# EAGLE design Adafruit Monochrome 1.12in 128x128 OLED (EAGLE 9.6.2)
COMPANY: ADAFRUIT INDUSTRIES; DRAWN: KTOWN; REV: A
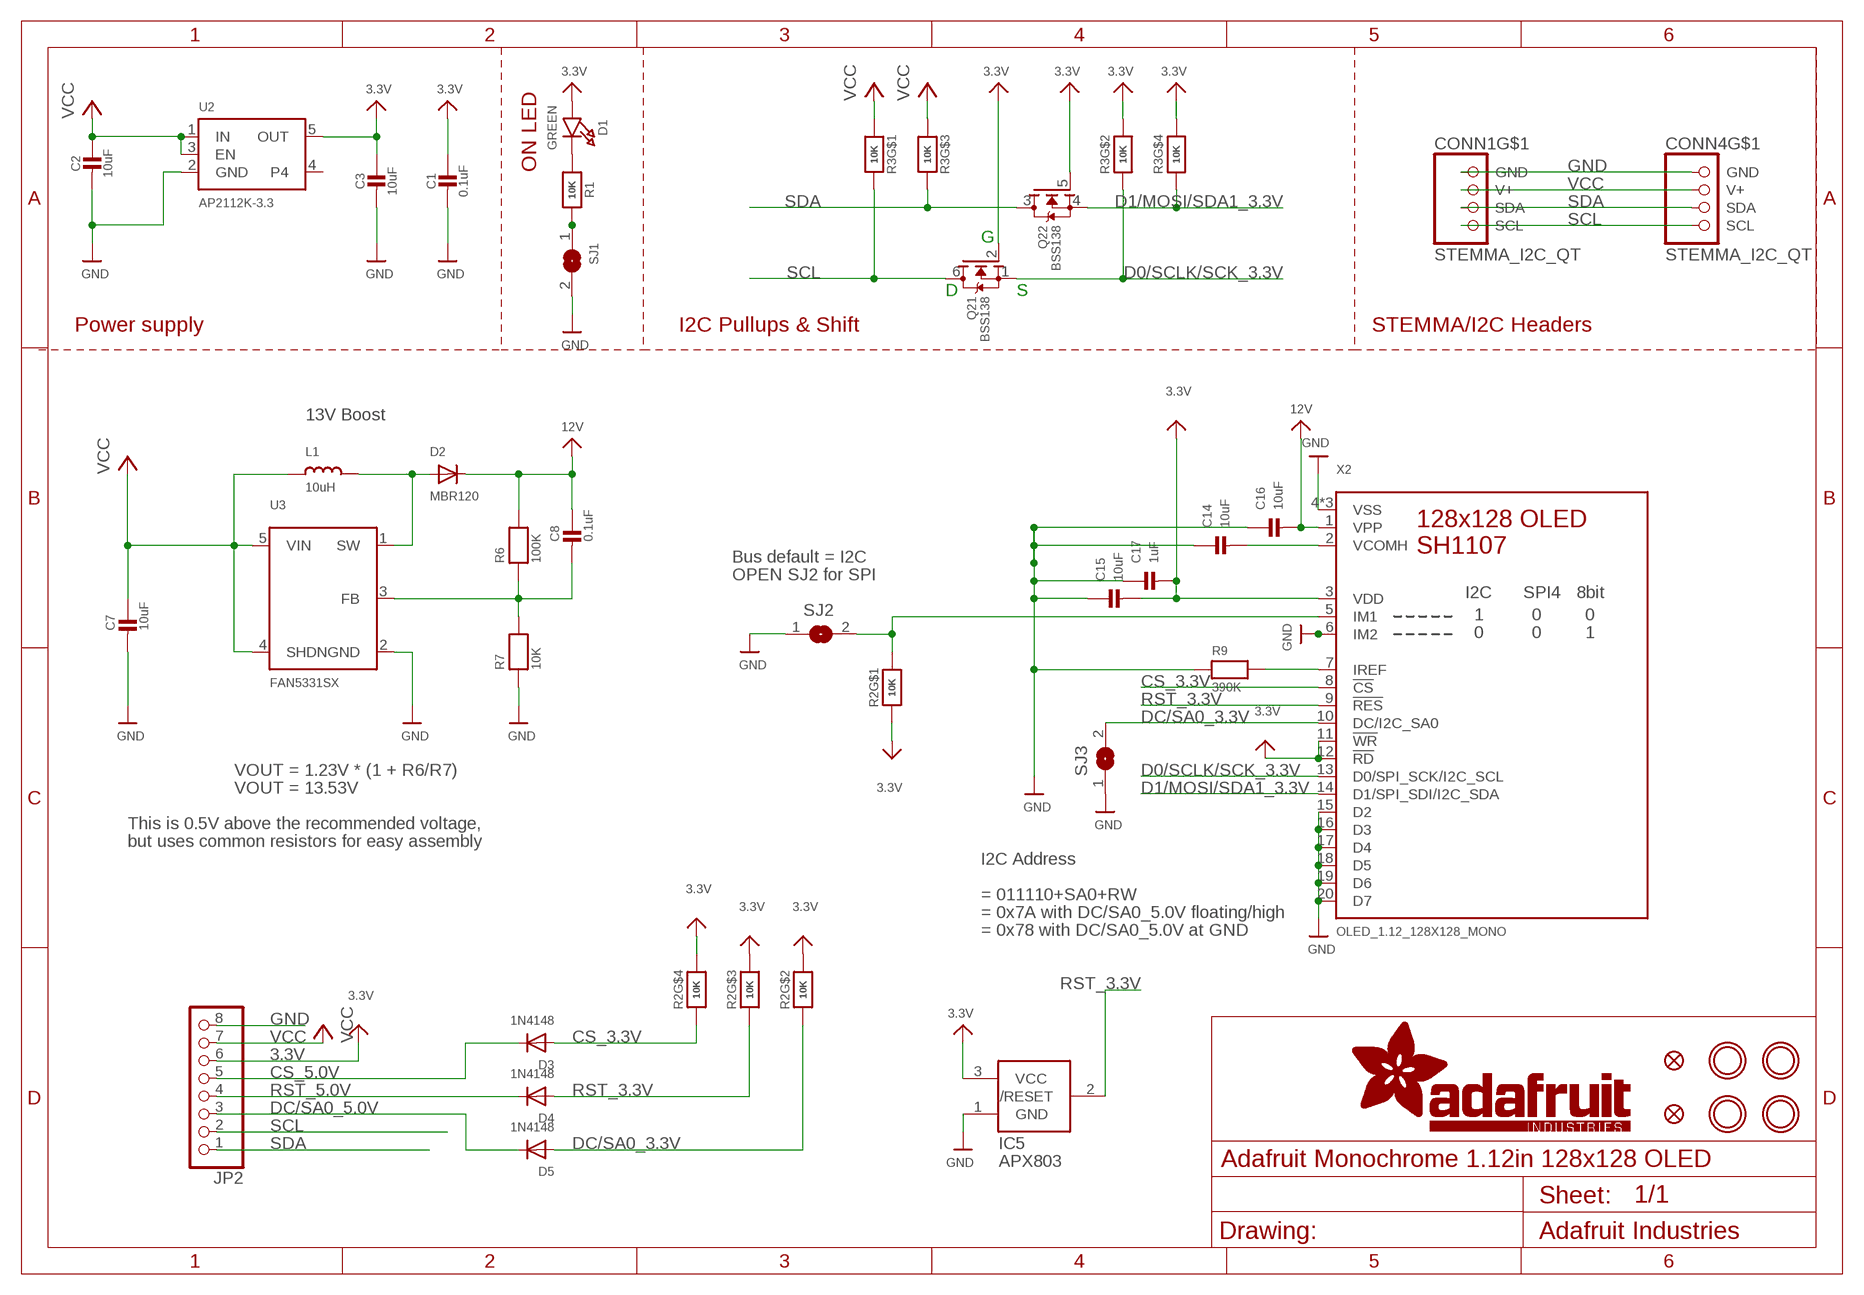
[diagram p0: schematic, sheet 1]

## Parts
C1  0.1uF  CAP_CERAMIC0603_NO  [0603-NO]
C2  10uF  CAP_CERAMIC0805-NOOUTLINE  [0805-NO]
C3  10uF  CAP_CERAMIC0805-NOOUTLINE  [0805-NO]
C7  10uF  CAP_CERAMIC0805-NOOUTLINE  [0805-NO]
C8  0.1uF  CAP_CERAMIC0603_NO  [0603-NO]
C14  10uF  CAP_CERAMIC0805-NOOUTLINE  [0805-NO]
C15  10uF  CAP_CERAMIC0805-NOOUTLINE  [0805-NO]
C16  10uF  CAP_CERAMIC0805-NOOUTLINE  [0805-NO]
C17  1uF  CAP_CERAMIC0603_NO  [0603-NO]
CONN1  STEMMA_I2C_QT  [JST_SH4]
CONN4  STEMMA_I2C_QT  [JST_SH4]
D1  GREEN  LED0603_NOOUTLINE  [CHIPLED_0603_NOOUTLINE]
D2  MBR120  DIODESOD-123  [SOD-123]
D3  1N4148  DIODESOD-323  [SOD-323]
D4  1N4148  DIODESOD-323  [SOD-323]
D5  1N4148  DIODESOD-323  [SOD-323]
FID3  FIDUCIAL_1MM  [FIDUCIAL_1MM]
FID4  FIDUCIAL_1MM  [FIDUCIAL_1MM]
IC5  APX803  AXP083-SAG  [SOT23]
JP2  HEADER-1X876MIL  [1X08_ROUND_76]
L1  10uH  INDUCTOR  [INDUCTOR_1007]
Q2  BSS138  MOSFET-N_DUAL  [SOT363]
R1  10K  RESISTOR_0603_NOOUT  [0603-NO]
R2  10K  RESISTOR_4PACK  [RESPACK_4X0603]
R3  10K  RESISTOR_4PACK  [RESPACK_4X0603]
R6  100K  RESISTOR_0603_NOOUT  [0603-NO]
R7  10K  RESISTOR_0603_NOOUT  [0603-NO]
R9  390K  RESISTOR_0603_NOOUT  [0603-NO]
SJ1  SOLDERJUMPERCLOSED  [SOLDERJUMPER_CLOSEDWIRE]
SJ2  SOLDERJUMPER  [SOLDERJUMPER_ARROW_NOPASTE]
SJ3  SOLDERJUMPER  [SOLDERJUMPER_ARROW_NOPASTE]
U2  AP2112K-3.3  VREG_SOT23-5  [SOT23-5]
U3  FAN5331SX  FAN5331  [SOT23-5@1]
U$1  MOUNTINGHOLE3.0THIN  [MOUNTINGHOLE_3.0_PLATEDTHIN]
U$17  MOUNTINGHOLE3.0THIN  [MOUNTINGHOLE_3.0_PLATEDTHIN]
U$19  MOUNTINGHOLE3.0THIN  [MOUNTINGHOLE_3.0_PLATEDTHIN]
U$21  MOUNTINGHOLE3.0THIN  [MOUNTINGHOLE_3.0_PLATEDTHIN]
X2  OLED_1.12_128X128_MONO  [OLED_1.12IN_128X128MONO]

## Nets
3.3V: C1.1 C3.1 C15.2 C17.2 D1.A IC5.3(VCC) JP2.6 Q2.2(1:G) Q2.5(2:G) R2.1 R2.5 R2.6 R2.7 R3.2 R3.4 U2.5(OUT) X2.3(VDD) X2.11(!WR) X2.12(!RD)
12V: C8.1 C16.2 D2.C R6.2 X2.1(VPP)
CS_3.3V: D3.A R2.4 X2.8(!CS)
CS_5.0V: D3.C JP2.5
D0/SCLK/SCK_3.3V: Q2.1(1:S) R3.7 X2.13(D0/SPI_SCK/I2C_SCL)
D1/MOSI/SDA1_3.3V: Q2.4(2:S) R3.5 X2.14(D1/SPI_SDI/I2C_SDA)
DC/SA0_3.3V: D5.A R2.2 SJ3.2 X2.10(DC/I2C_SA0)
DC/SA0_5.0V: D5.C JP2.3
GND: C1.2 C2.2 C3.2 C7.2 C14.1 C15.1 C16.1 C17.1 CONN1.1(GND) CONN4.1(GND) IC5.1(GND) JP2.8 R7.1 R9.1 SJ1.2 SJ2.1 SJ3.1 U2.2(GND) U3.2(GND) X2.4(VSS) X2.6(IM2) X2.15(D2) X2.16(D3) X2.17(D4) X2.18(D5) X2.19(D6) X2.20(D7) X2.21(VSS) X2.22(VSS)
N$1: R1.2 SJ1.1
N$2: D1.C R1.1
N$5: D2.A L1.P$2 U3.1(SW)
N$8: C8.2 R6.1 R7.2 U3.3(FB)
N$9: R2.8 SJ2.2 X2.5(IM1)
N$10: R9.2 X2.7(IREF)
N$15: C14.2 X2.2(VCOMH)
RST_3.3V: D4.A IC5.2(/RESET) R2.3 X2.9(!RES)
RST_5.0V: D4.C JP2.4
SCL: CONN1.4(SCL) CONN4.4(SCL) JP2.2 Q2.6(1:D) R3.8
SDA: CONN1.3(SDA) CONN4.3(SDA) JP2.1 Q2.3(2:D) R3.6
VCC: C2.1 C7.1 CONN1.2(V+) CONN4.2(V+) JP2.7 L1.P$1 R3.1 R3.3 U2.1(IN) U2.3(EN) U3.4(SHDN) U3.5(VIN)
Unconnected: CONN1.MT1(MT) CONN1.MT2(MT) CONN4.MT1(MT) CONN4.MT2(MT) U2.4

## Notes on the sheet
- ON LED
- G
- D | S
- Power supply | I2C Pullups & Shift | STEMMA/I2C Headers
- 13V Boost
- Bus default = I2C
- OPEN SJ2 for SPI
- VOUT = 1.23V * (1 + R6/R7)
- VOUT = 13.53V
- This is 0.5V above the recommended voltage,
- but uses common resistors for easy assembly
- I2C Address
- = 011110+SA0+RW
- = 0x7A with DC/SA0_5.0V floating/high
- = 0x78 with DC/SA0_5.0V at GND

## Library data of the parts
C1-C3 C7 C8 C14-C17 = microbuilder:CAP_CERAMIC: Ceramic Capacitors For new designs, use the packages preceded by an '_' character since they are more reliable: The following footprints should be used on most boards: _0402 - Standard footprint for regular board layouts _0603 - Standard footprint for regular board layouts _0805 - Standard footprint for regular board layouts _1206 - Standard footprint for regular board layouts For extremely tight-pitch boards where space is at a premium, the following 'micro-pitch' footprints can be used (smaller pads, no silkscreen outline, etc.): _0402MP - Micro-pitch footprint for very dense/compact boards _0603MP - Micro-pitch footprint for very dense/compact boards _0805MP - Micro-pitch footprint for very dense/compact boards _1206MP - Micro-pitch footprint for very dense/compact boards
CONN1 CONN4 = microbuilder:STEMMA_I2C
D1 = microbuilder:LED: LED 0603 - 0603 Surface Mount Package 2mA: Green LED - Low Power (3.9mcd, 2ma, 1.7Vf) - Digikey: 475-2709-2-ND Orange LED - Low Power (9.8mcd, 2ma, 1.8Vf) - Digikey: 475-1194-2-ND Red LED - Low Power (5mcd, 2ma, 1.8Vf) - Digikey: 475-1195-2-ND Yellow LED - Low Power (7mcd, 2ma, 1.8Vf) - Digikey: 475-1196-2-ND 5mA: Blue LED - Low Power (17mcd, 5ma, 2.9Vf) - Digikey: LNJ937W8CRACT-ND 0805 - 0805 Surface Mount Package 2mA: Red LED (8.8mcd, 2mA, 1.8Vf, Clear) - Low Power [Digikey: 475-2510-1-ND] Green LED (5mcd, 2mA, 1.8Vf, Clear) - Low Power [Digikey: 475-2730-1-ND] Yellow LED (11.3mcd, 2mA, 1.8Vf, Clear) - Low Power [Digikey: 475-2555-1-ND] 20mA: Red LED (104mcd, 20mA, Diffused) - LS R976 [Digikey: 475-1278-6-ND] Red LED (12mcd, 20mA, 2.0Vf, Clear) - APT2012EC [Digikey: 754-1128-1-ND] Green LED (15mcd, 20mA, 2.2Vf, Clear) - APT2012GC [Digikey: 754-1131-1-ND] Orange LED (160mcd, 20mA, 2.1Vf, Clear) - APT2012SECK [Digikey: 754-1130-1-ND] 1206 - 1206 Surface Mount Package Green LED (26mcd, 20mA, Diffused) - LG N971 [Digikey: 475-1407-6-ND] Red LED (15mcd, 20mA, Diffused) - LH N974 [Digikey: 475-1416-6-ND] Cree - Cree High-Power Surface Mount LEDs XPEBWT-L1-0000-00D50 - White 111lm 350mA 2.9Vf 6200K 110° XTEAWT-00-0000-00000LEE3 - White 114lm 350mA 2.85Vf 5000K 115° Everlight - Everlight 45-21 Series Surface Mount LEDs 45-21/QK2C-B2832AC2CB2/2T - Warm White 2000mcd 20mA 3.25Vf 3050K 120° 45-21/LK2C-B38452C4CB2/2T - Nuetral White 2000mcd 20mA 3.25Vf 4150K 120° 45-21/LK2C-B50634C6CB2/2T - Cold White 2200mcd 20mA 3.25Vf 5650K 120° PLCC2 Reverse Mount LS T77K-J1L2-1-0-2-R18-Z - Red 11.25mcd 2mA 1.8Vf 630nm 120° LO T77K-L1M2-24-Z - Orange 19.6mcd 2mA 1.8Vf 606nm 120° LY T77K-K2M1-26-Z - Yellow 15.7mcd 2mA 1.8Vf 587nm 120°
D2-D5 = microbuilder:DIODE: Diode SMA Model Volts Amps Type Vf Ir Digikey # Notes SSA34-E3 40V 3A Schottky 480mV @ 3A 200uA @ 40V SSA34-E3/61TGITR-ND CDBA120-G 20V 1A Schottky 500mV @ 1A 500uA @ 20V 641-1014-6-ND REEL MBRA210 10V 2A Schottky 350mV @ 2A 700uA @ 10V MBRA210LT3 SOD-123 Model Volts Amps Type Vf Ir Order # Notes BAT54T1G 30V 200mA Schottky 800mV @ 200mA 2uA @ 25V BAT54T1GOSTR-ND B0530W 30V 500mA Schottky 430mV @ 500mA 130uA @ 30V B0530W-FDICT-ND REEL MBR120 20V 1A Schottky 340mV @ 1A MBR120VLSFT1GOSCT-ND SOD-323 Model Volts Amps Type Vf Ir Order # Notes PMEG2005EJ 20V 500mA Schottky 355mV @ 500mA 568-4110-1-ND ZLLS410 10V 570mA Schottky 380mV @ 570mA ZLLS410CT-ND 1N4148WS 75V 150mA Silicon/Simple 1V 1N4148WSFSCT-ND REEL SOD-523 Model Volts Amps Type Vf Ir Order # Notes BAT54XV2 30V 200mA Schottky 0.8V @ 100mA BAT54XV2CT-ND TB751S 30V 30mA Schottky RB751S-40TE61CT-ND SOT23-R/W (R = Solder Paste/Reflow Ovens, W = Hand-Soldering) Model Volts Amps Type Vf Ir Order # Notes BAT54FILM 40V 300mA Schottky 497-7162-1-ND POWERDI-5 Model Volts Amps Type Vf Ir Order # Notes PDS560 60V 5A Schottky 670mV @ 5A 150uA @ 60V PDS560DICT-ND
FID3 FID4 = microbuilder:FIDUCIAL: Fiducial Alignment Points Various fiducial points for machine vision alignment.; BOM: EXCLUDE
IC5 = adafruit:AXP083
JP2 = microbuilder:HEADER-1X8: PIN HEADER
L1 = microbuilder:INDUCTOR: Inductors 0603: 10nH Ceramic Inductor - microwire antenna/RF (Digikey: 712-1434-2-ND) 0805: 560nH Ceramic Inductor - RF (Digikey: 553-1047-1-ND) 270nH Ceramic Inductor - Q = 40@250MHz, +-5%, 1 Ohm DC Resistance (Digikey: 535-10506-2-ND) 1007 (2518 Metric) SMT: 10µH 10% 250mOhm 820mA 1007 Inductor (Digikey: 587-2189-1-ND) 22µH 10% 500mOhm 580mA 1007 Inductor (Digikey: 587-2190-1-ND) 47µH 10% 950mOhm 420mA 1007 Inductor (Digikey: 587-2191-1-ND) 47µH 5% 100mOhm 1A 1008 Inductor (Digikey: 732-1816-1-ND) 5.0x5.0mm (Taiyo Yuden NR5040 Series) 6.8µH 20% 2.3A 64mOhm Inductor (Digikey: 587-2374-2-ND) 5.0x5.0mm (TDK VLC5045 Series) 4.7µH 20% 3.3A 34mOhm Inductor (Digikey: 445-6526-1-ND) 6.8µH 20% 2.7A 46mOhm Inductor (Digikey: 445-6527-1-ND) 6.0x6.0mm (TDK VLC6045 Series) 4.7µH 20% 3.8A 27mOhm Inductor (Digikey: 445-6538-2-ND) 6.8µH 20% 3A 41mOhm Inductor (Digikey: 445-6540-1-ND) 6.2µH 30% 2.2A 45mOhm Inductor (Digikey: SRR5028-6R2YCT-ND) - Not TDK VLC6045 but footprint should match 6.0x6.0mm (TDK SLF6045 Series) 6.8uH 30% 2A 33mOhm Inductor (Digikey: 445-4572-1-ND, Mouser: 810-SLF645T6R8N2R0PF) 6.0x6.0mm (Sumida CDRH5D28 Series) 6.2uH 30% 1.8A 45mOhm Inductor (Digikey: 308-1542-1-ND) Taiyo Yuden NR3015T2R2M - 2.2uH 20% 1.5A (Digikey: 587-1648-2-ND, Mouser: 963-NR3015T2R2M) - Used with TI TPS62172 CoilCraft RFID Transponder Coil - MA5532-AE (For use with AS3935 Lightning Sensor) Taiyo Yuden NRH2412T2R2MNGH - 2.2uH 20% 1AA (Digikey: 587-3443-1-ND) - Used with TI LM3671 Vishay IHLP 1.0uH Molded Inductor - 24mOhm DCR, 5A, +/-20%, -55°C-125°C (Digikey: 541-1319-1-ND)
Q2 = microbuilder:MOSFET-N_DUAL: Dual N-Channel MOSFET SOT363 (2.0x1.25mm) 2N7002PS - 60V, 320mA [Digikey: 568-5984-1-ND]
R1 R6 R7 R9 = microbuilder:RESISTOR: Resistors For new designs, use the packages preceded by an '_' character since they are more reliable: The following footprints should be used on most boards: _0402 - Standard footprint for regular board layouts _0603 - Standard footprint for regular board layouts _0805 - Standard footprint for regular board layouts _1206 - Standard footprint for regular board layouts For extremely tight-pitch boards where space is at a premium, the following 'micro-pitch' footprints can be used (smaller pads, no silkscreen outline, etc.): _0402MP - Micro-pitch footprint for very dense/compact boards _0603MP - Micro-pitch footprint for very dense/compact boards _0805MP - Micro-pitch footprint for very dense/compact boards _1206MP - Micro-pitch footprint for very dense/compact boards
R2 R3 = microbuilder:RESISTOR_4PACK: Resistor Packs (4 resistors) 4 x 0603 10K 1/16W - Digikey: YC164J-10KCT-ND
SJ1 = microbuilder:SOLDERJUMPER: SMD Solder JUMPER Solder the two pads together to create a connection, or remove the solder to break it. REFLOW - Use this footprint for solder paste and reflow ovens. WAVE - Use this footprint for hand-soldering (larger pads). CLOSED - Has a trace between the two pads to ensure it is closed by default. The trace needs to be cut to disable the jumper, and can be closed again by creating a solder bridge between the two pads.
SJ2 SJ3 = microbuilder:SOLDERJUMPER: SMD Solder JUMPER Solder the two pads together to create a connection, or remove the solder to break it. REFLOW - Use this footprint for solder paste and reflow ovens. WAVE - Use this footprint for hand-soldering (larger pads). CLOSED - Has a trace between the two pads to ensure it is closed by default. The trace needs to be cut to disable the jumper, and can be closed again by creating a solder bridge between the two pads.; BOM: EXCLUDE
U2 = microbuilder:VREG_SOT23-5: SOT23-5 Fixed Voltage Regulators Part Current Out V Out V In V Dropout θJA (°C/W) TJ (°C) Digikey Part No. ADP121 150mA 3.3V 3.4-5.5V 0.09V @ 150mA -- -- ADP121-AUJZ33R7CT-ND ADP121 150mA 3.0V 3.1-5.5V 0.09V @ 150mA -- -- ADP121-AUJZ30R7CT-ND ADP122 300mA 3.3V 3.4-5.5V 0.085V @ 300mA -- -- ADP122AUJZ-3.3-R7CT-ND ADP1712 300mA 3.3V 3.5-5.5V 0.17V @ 300mA -- -- ADP1712AUJZ-3.3-R7TR-ND AP7311 (Low Cost) 150mA 3.3V 3.5-6V 0.15V @ 150mA -- -- AP7311-33WG-7DICT-ND LD39015M18R 150mA 1.8V 1.9V-5.5V 0.08V @ 100mA -- -- 497-6977-1-ND LP2985A-33DBVR 150mA 3.3V 3.3-16V 0.28V @ 150mA 206 150 296-18479-1-ND MCP1824T-3302E/OT 300mA 3.3V 3.5V-6V 0.2V @ 300mA -- -- MCP1824T-3302E/OTCT-ND MIC5205-2.5YM5 TR 150mA 2.5V 2.7-16V 0.165V @ 150mA -- -- 576-1257-2-ND MIC5205-3.0YM5 TR 150mA 3.0V 3.2V-16V 0.165V @ 150mA -- -- 576-1258-2-ND MIC5205-3.3YM5 TR 150mA 3.3V 3.5V-16V 0.165V @ 150mA -- -- 576-1259-2-ND TPS780330220 150mA 3.3V+2.2V 3.6-5.5V 250mV Max -- -- 296-23332-1-ND TDA3663/N1,135 100mA 3.3V 3.5-45V 0.18V @ 50mA -- -- 568-5343-1-ND Max operating temp can be calculated using θJA, TJ (max junction temperature), and power in watts. Set the "Maximum Ambient Temperature" until it reaches TJ ("Max Junction Temperature"), which is the absolute limit for safe use of the regulator: Heat Sink Temperature Calculator <http://www.daycounter.com/Calculators/Heat-Sink-Temperature-Calculator.phtml> For example, With 12V source into a 3.3V LP2985 and a 30mA load, we are dissipating (12V-3.3V) * 0.03A = 0.261W. With a θJA of 206 °C/W, a TJ of 150°C, and 261mW we can safely use the chip without a heat sink up to 75°C (=147.1°C Junction Temperature).
U3 = microbuilder:FAN5331: FAN5331 - LED/OLED 20V Boost Converter Digikey: FAN5331SXCT-ND
U$1 U$17 U$19 U$21 = microbuilder:MOUNTINGHOLE: Mounting Hole For #2 screws (0.086"/2.18mm width, 0.094"/2.4mm hole) use 2.5mm; BOM: EXCLUDE
X2 = adafruit_display:OLED_1.12_128X128_MONO

## Board
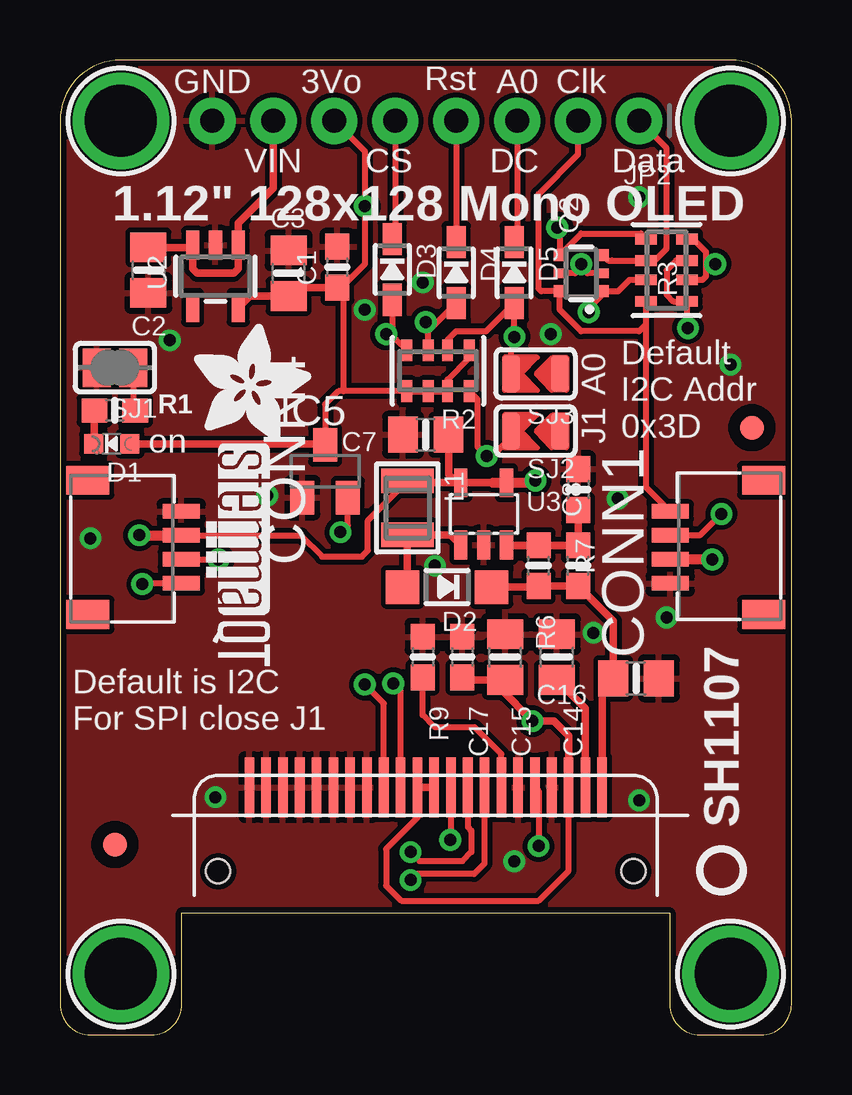
[diagram p1: board, top side]
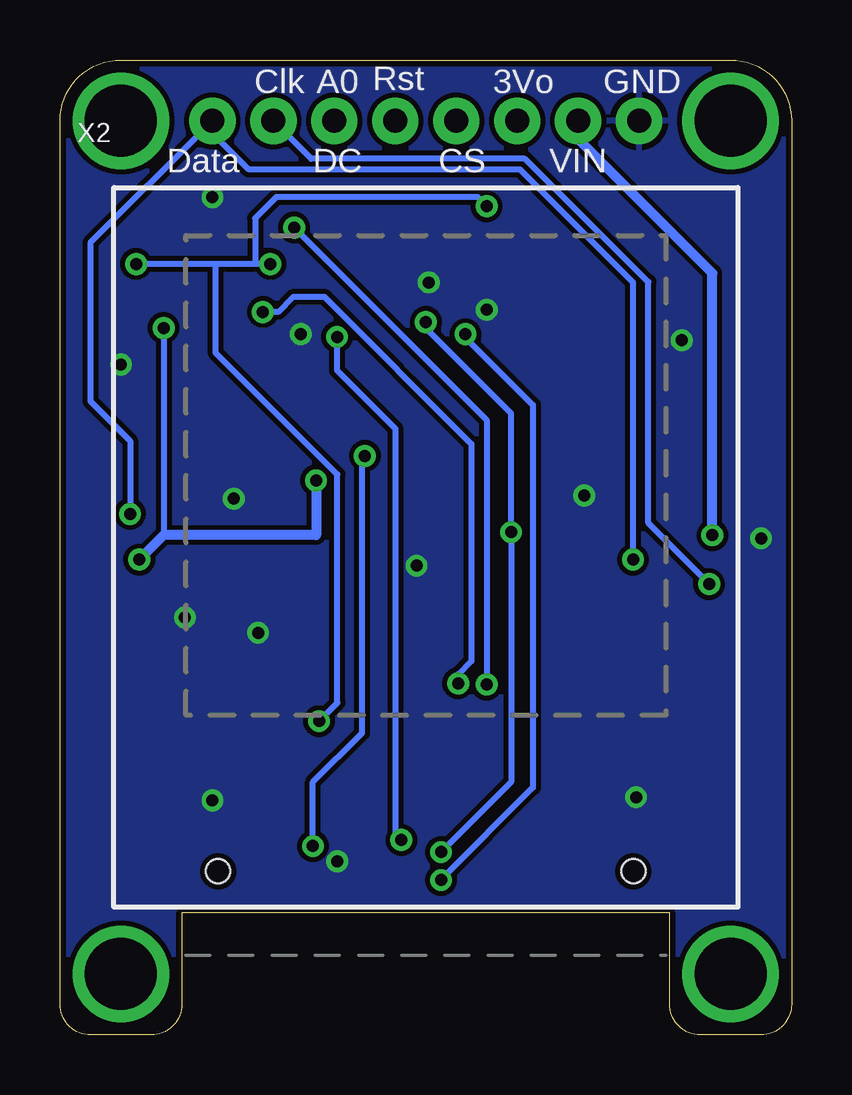
[diagram p2: board, bottom side, seen from below]

Size 30.48 x 40.64 mm. Coordinates in mm from the lower left corner, seen from the top.
Outline: 26.67,0 29.21,0 arc90 30.48,1.27 30.48,38.1 arc90 27.94,40.64 2.54,40.64 arc90 0,38.1 0,1.27 arc90 1.27,0 3.81,0 arc90 5.08,1.27 5.08,5.08 25.4,5.08 25.4,1.27 arc90 26.67,0
Copper layers (1*16): Top 0.035mm / dielectric 1.5mm / Bottom 0.035mm
Design rules "adafruit *": minimum track width 8mil, minimum drill 15.5mil, track to track 8mil, track to pad 8mil, pad to pad 8mil, via to via 8mil, smd to smd 8mil, copper to edge 10mil, drill to drill 8mil, minimum pad ring 10mil, minimum via ring 8mil, stop-mask expansion 2mil, vias tented up to drill 20mil, thermal gap 10mil

### Footprints (pad centres in the part's own frame; a part is rotated, then mirrored left to right if it is on the bottom)
0603-NO = smd 1.075 x 1: 1 -0.85,0; 2 0.85,0
0805-NO = smd 1.24 x 1.5: 1 -0.95,0; 2 0.95,0
JST_SH4 = smd 0.6 x 1.55: 1 -1.5,2.514; 2 -0.5,2.514; 3 0.5,2.514; 4 1.5,2.514 | smd 1.2 x 1.8: MT1 -2.8,-1.386; MT2 2.8,-1.386
CHIPLED_0603_NOOUTLINE = smd 0.8 x 0.8: A 0,-0.75; C 0,0.75
SOD-123 = smd 1.4 x 1.4: A 1.85,0; C -1.85,0
SOD-323 = smd 1.35 x 0.8: A 1.27,0; C -1.27,0
FIDUCIAL_1MM = smd 1 x 1: 1 0,0
SOT23 = smd 1 x 1.4: 1 -0.95,-1.1; 2 0.95,-1.1; 3 0,1.1
1X08_ROUND_76 = drill 1 pad 1.93: 1 -8.89,0; 2 -6.35,0; 3 -3.81,0; 4 -1.27,0; 5 1.27,0; 6 3.81,0; 7 6.35,0; 8 8.89,0
INDUCTOR_1007 = smd 1.016 x 2.2: P$1 -1.127,0; P$2 1.127,0
SOT363 = smd 0.5 x 0.5: 1 -0.75,-0.9; 3 0.75,-0.9; 4 0.75,0.9; 6 -0.75,0.9 | smd 0.4 x 0.5: 2 0,-0.9; 5 0,0.9
RESPACK_4X0603 = smd 0.45 x 0.9: 1 -1.3,-0.85; 2 -0.4,-0.85; 3 0.4,-0.85; 4 1.3,-0.85; 5 1.3,0.85; 6 0.4,0.85; 7 -0.4,0.85; 8 -1.3,0.85
SOLDERJUMPER_CLOSEDWIRE = smd 1.168 x 1.6: 1 -0.762,0; 2 0.762,0 | smd 0.635 x 0.203: WIRE 0,0
SOLDERJUMPER_ARROW_NOPASTE = smd 0.762 x 1.524: 1 -1.016,0; 2 1.016,0
SOT23-5 = smd 0.55 x 1.2: 1 -0.95,-1.3; 2 0,-1.3; 3 0.95,-1.3; 4 0.95,1.3; 5 -0.95,1.3
SOT23-5@1 = smd 0.55 x 1.2: 1 -0.95,-1.3; 2 0,-1.3; 3 0.95,-1.3; 4 0.95,1.3; 5 -0.95,1.3
MOUNTINGHOLE_3.0_PLATEDTHIN = drill 3 pad 3.6: P$1 0,0
OLED_1.12IN_128X128MONO = smd 0.4 x 2.5 bottom: 1 -7.35,-10; 2 -6.65,-10; 3 -5.95,-10; 4 -5.25,-10; 5 -4.55,-10; 6 -3.85,-10; 7 -3.15,-10; 8 -2.45,-10; 9 -1.75,-10; 10 -1.05,-10; 11 -0.35,-10; 12 0.35,-10; 13 1.05,-10; 14 1.75,-10; 15 2.45,-10; 16 3.15,-10; 17 3.85,-10; 18 4.55,-10; 19 5.25,-10; 20 5.95,-10; 21 6.65,-10; 22 7.35,-10 | hole 1: -8.65,-13.5; 8.65,-13.5

### Placement (x,y rotation side)
C1  11.56,32 90 top
C2  3.68,31.88 270 top
C3  9.53,31.75 90 top
C7  15.24,25.02 180 top
C8  21.59,19.56 90 top
C14  20.7,15.75 270 top
C15  18.54,15.75 270 top
C16  24,14.86 180 top
C17  16.76,15.75 270 top
CONN1  27.94,20.32 90 top
CONN4  2.54,20.32 270 top
D1  2.16,24.64 90 top
D2  16.13,18.67 180 top
D3  13.84,31.9 270 top
D4  16.51,31.78 270 top
D5  18.92,31.78 270 top
FID3  2.29,7.94 0 top
FID4  28.83,25.31 0 top
IC5  11.05,23.49 0 top
JP2  15.24,38.1 180 top
L1  14.48,21.97 270 top
Q2  21.72,31.75 90 top
R1  2.29,26.03 0 top
R2  15.75,27.69 180 top
R3  25.27,31.88 90 top
R6  19.94,19.56 270 top
R7  21.59,22.73 270 top
R9  15.11,15.75 270 top
SJ1  2.29,27.81 180 top
SJ2  19.81,25.17 180 top
SJ3  19.81,27.56 180 top
U2  6.48,31.62 180 top
U3  17.65,21.72 0 top
U$1  2.54,38.1 0 top
U$8  [ADAFRUIT_5MM]  5.59,24.77 0 top
U$17  27.94,38.1 0 top
U$19  2.54,2.54 0 top
U$21  27.94,2.54 0 top
U$25  [PCBFEAT-REV-040]  27.56,6.86 0 top
U$31  [STEMMAQT]  6.1,24.64 270 top
X2  15.24,20.32 0 bottom

### Tracks (layer width: path | path; a pad name or v marks a point on that pad's centre or on a via)
3.3V  (via drill 0.5)
  Top 0.254: v21.72,32.13 21.72,32.02 | 21.72,32.02 21.45,31.75 Q2.5 | R3.2 26.78,31.48 26.92,31.62 26.92,32.13 | 26.92,32.13 26.92,32.64 26.39,33.18 R3.4 | Q2.2 21.98,31.75 21.72,32.02 | v27.3,32.13 26.92,32.13 | JP2.6 12.7,36.83 v12.7,34.54 12.7,32.13 11.56,30.99 | X2.12 14.89,9.05 13.59,7.75 13.59,6.22 14.22,5.59 19.94,5.59 21.19,6.84 X2.3 | R2.7 16.15,27.32 17.05,28.22 R2.1 | R2.5 11.81,26.84 | 11.81,26.84 11.6,26.84 11.05,26.29 IC5.3 | C1.1 11.81,30.9 11.81,26.84 | 19.49,13.27 v19.68,13.08
  Top 0.305: U2.5 7.9,30.8 C3.1 9.88,31.15 C1.1 11.56,30.99 | R2.5 R2.6 R2.7 | D1.A 11.01,24.64 IC5.3 | X2.12 X2.11 | C17.2 16.76,14.86 16.82,14.8 C15.2 18.54,14.22 19.49,13.27 | X2.3 21.19,12.46 20.57,13.08 v19.68,13.08
  Bottom 0.254: v21.72,32.13 22.35,32.13 | 22.35,32.13 24,32.13 | 24,32.13 v27.3,32.13 | 24,32.13 24,28.45 18.92,23.37 18.92,13.84 v19.68,13.08 | v12.7,34.54 13.08,34.92 21.46,34.92 22.35,34.04 22.35,32.13
12V
  Top 0.305: X2.1 22.59,14.4 C16.2 23.05,17.24 C8.1 R6.2 19.9,18.67 D2.C
CS_3.3V  (via drill 0.5)
  Top 0.254: D3.A 13.84,29.14 14,28.98 | 14,28.98 R2.4 | 14,28.98 13.81,28.98 v13.59,29.21 | v14.61,6.46 14.86,6.71 17.25,6.71 17.69,7.15 X2.8
  Bottom 0.254: v13.59,29.21 13.59,29.07 10.77,26.26 10.77,10.31 14.61,6.48 v14.61,6.46
CS_5.0V
  Top 0.254: JP2.5 13.97,33.3 D3.C
D0/SCLK/SCK_3.3V  (via drill 0.5)
  Top 0.254: Q2.1 22.73,31 | 22.73,31 23.25,31 23.73,31.48 R3.7 | X2.13 14.19,14.35 v13.89,14.65 | v22.03,30.13 21.95,30.21 22.73,31
  Bottom 0.254: v13.89,14.65 13.89,15.03 13.34,15.59 13.34,24.64 19.46,30.77 20.76,30.77 21.39,30.13 v22.03,30.13
D1/MOSI/SDA1_3.3V  (via drill 0.5)
  Top 0.254: R3.5 24.2,33.4 21.72,33.4 Q2.4 20.82,33.56 v20.72,33.66 | X2.14 13.49,13.81 v12.7,14.61
  Bottom 0.254: v12.7,14.61 12.7,25.63 v20.72,33.66
DC/SA0_3.3V  (via drill 0.5)
  Top 0.254: R2.2 16.15,28.98 16.51,29.34 17.75,29.34 D5.A 18.92,29.1 v18.94,29.1 18.94,28.72 18.8,28.58 SJ3.2 | X2.10 16.29,8.16 v16.26,8.13
  Bottom 0.254: v16.26,8.13 16.51,8.38 16.51,25.27 18.94,27.7 v18.94,29.1
DC/SA0_5.0V
  Top 0.254: JP2.3 19.05,33.17 D5.C
GND  (via drill 0.5)
  other vias: 23.24,22.35 15.62,19.56 22.23,16.76 25.27,17.4 8.64,22.48 12.7,30.23 15.11,31.37 20.45,29.21 27.94,27.94 24.13,34.92 4.57,28.96 1.27,20.7 6.48,9.91 24.13,9.78 18.92,7.24
  pour Top: 0,40.64 30.48,40.64 30.48,0 29.72,0 0,0
  pour Bottom: 0,40.64 30.48,40.64 30.48,0 0,0
N$1
  Top 0.254: SJ1.1 3.05,26.12 R1.2
N$2
  Top 0.305: R1.1 1.44,24.66 D1.C
N$5
  Top 0.305: U3.1 16.28,20.84 L1.P$2 14.48,18.87 D2.A
N$8
  Top 0.305: R7.2 C8.2 R6.1 18.61,20.41 U3.3
N$9  (via drill 0.5)
  Top 0.254: X2.5 19.94,10.17 v19.94,7.87 | R2.8 17.4,26.48 17.4,24.51 v17.78,24.13 18.01,24.13 18.8,24.91 SJ2.2
  Bottom 0.254: v19.94,7.87 19.94,10.54 17.91,12.57 17.91,24 v17.78,24.13
N$10
  Top 0.254: X2.7 18.39,11.71 17.27,12.83 15.62,12.83 15.11,13.34 R9.2
N$15
  Top 0.305: X2.2 21.89,13.61 C14.2
RST_3.3V  (via drill 0.5)
  Top 0.254: R2.3 15.35,29.34 | 15.35,29.34 D4.A | X2.9 16.99,8.66 17.14,8.51 17.14,7.62 16.76,7.24 14.99,7.24 v14.61,7.62 | v11.68,20.95 11.7,20.95 12,21.25 IC5.2 | v15.24,29.72 15.35,29.61 15.35,29.34
  Bottom 0.254: v14.61,7.62 11.68,10.54 v11.68,20.95 11.68,25.91 15.24,29.46 v15.24,29.72
RST_5.0V
  Top 0.254: JP2.4 D4.C
SCL  (via drill 0.5)
  Top 0.254: 24.42,29.63 24.13,29.34 21.72,29.34 20.82,30.24 Q2.6 20.05,31 19.94,31.12 19.94,35.05 21.59,36.7 JP2.2 | CONN1.4 24.42,22.82 24.42,29.63 | 24.42,29.63 R3.8 | CONN4.4 3.45,18.82 v3.43,18.8
  Bottom 0.254: v3.43,18.8 5.97,21.34 5.97,31.38 11.11,36.52 20.02,36.52 JP2.2
SDA  (via drill 0.5)
  Top 0.254: Q2.3 22.84,32.28 23,32.28 23.01,32.28 R3.6 24.78,32.28 25.27,32.77 25.27,36.96 JP2.1 | v27.56,21.72 26.66,20.82 CONN1.3 | CONN4.3 v6.6,19.82 v6.6,19.81
  Bottom 0.254: JP2.1 24.38,37.85 | 24.38,37.85 29.21,33.02 29.21,26.42 27.56,24.77 v27.56,21.72 | v6.6,19.81 6.6,31.37 11.3,36.07 22.61,36.07 24.38,37.85
VCC  (via drill 0.5)
  Top 0.254: R3.3 25.67,32.28 25.27,31.88 25.27,30.86 25.56,30.58 R3.1 26.12,29.5 v26.16,29.46 | CONN4.2 10.04,20.82 10.92,19.94 12.57,19.94 12.83,20.19 12.83,21.45 L1.P$1
  Top 0.305: JP2.7 8.89,35.31 7.43,33.84 U2.1 7.43,31.94 7.24,31.75 5.71,31.75 5.53,31.94 U2.3 5.43,32.83 C2.1 | C7.1 16.19,23.37 16.54,23.02 U3.4 18.03,23.02 U3.5 14.56,23.02 L1.P$1
  Top 0.406: CONN4.2 v3.31,20.82 v3.3,20.83 | v27.18,19.81 CONN1.2 | 18.03,23.02 19.71,23.02 v19.81,23.11
  Bottom 0.254: v26.16,29.46 26.16,20.83
  Bottom 0.406: v27.18,19.81 26.16,20.83 19.81,20.83 v19.81,23.11 | JP2.7 8.89,37.34 3.3,31.75 v3.3,20.83

### Text on the board
tPlace: GND | 3Vo | Rst | A0 | Clk | VIN | CS | DC | Data | 1.12" 128x128 Mono OLED | A0 | J1 | Default / I2C Addr / 0x3D | on | Default is I2C / For SPI close J1 | SH1107
bPlace: GND | 3Vo | Rst | A0 | Clk | VIN | CS | DC | Data